# Altium project OT.PrjPcb (part 2 of 2)
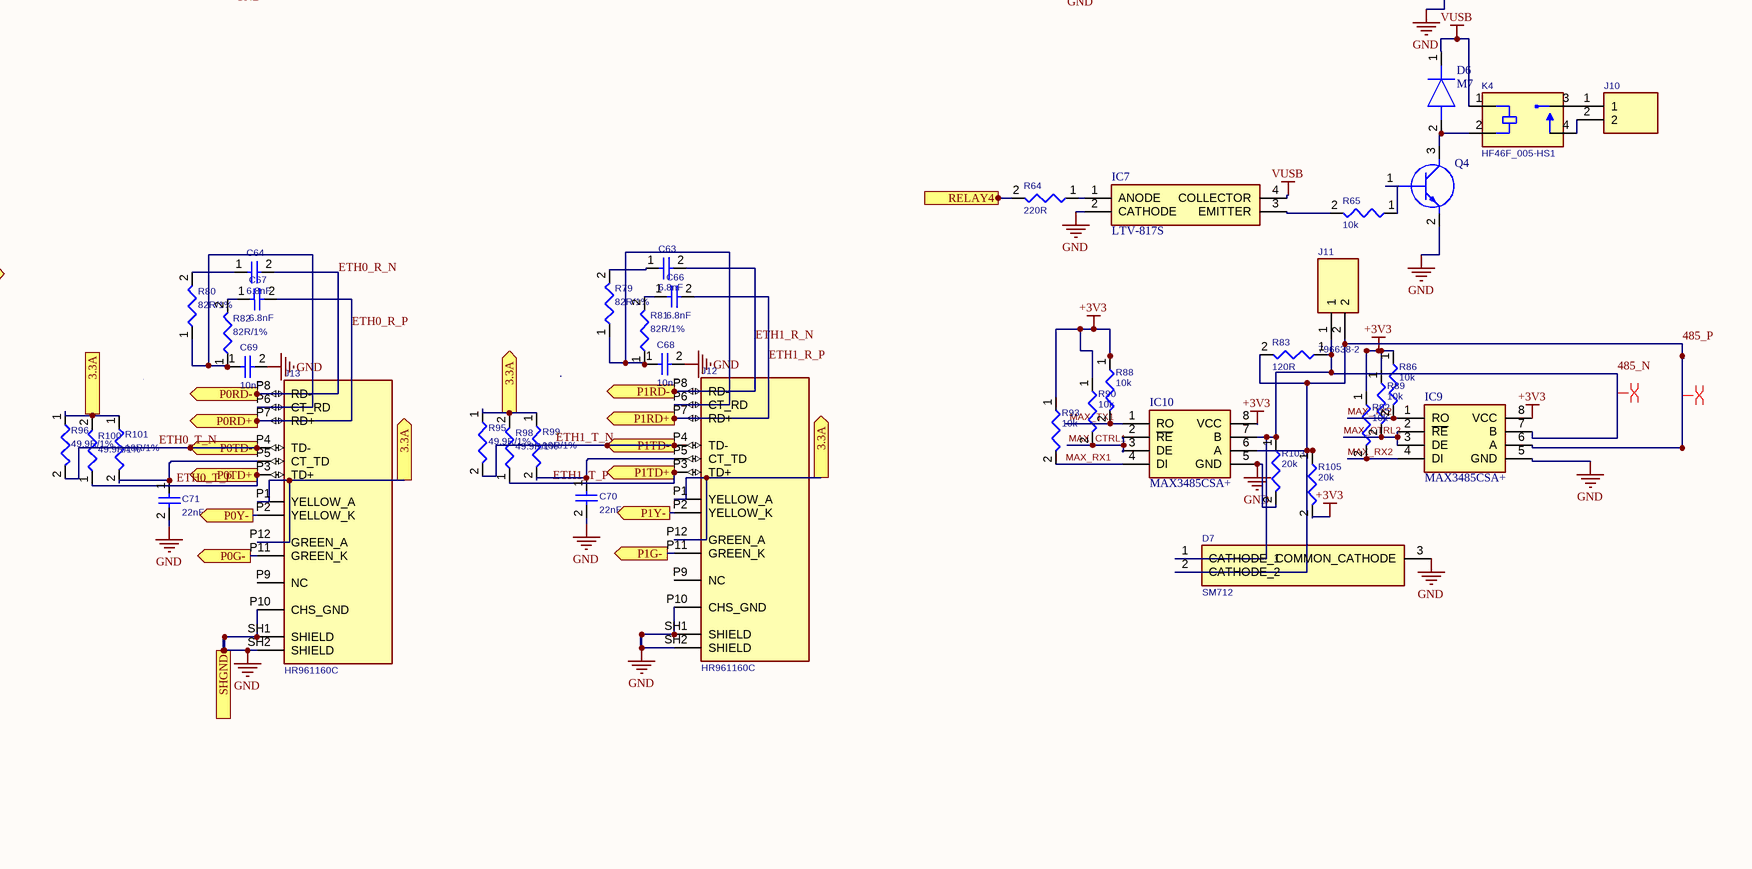
[diagram p4: Sheet_1.SchDoc, bottom right]

## Sheet Sheet_1.SchDoc (continued)

### Library data of the parts
B1 = RTL8367S-CG: Integrated Circuits (ICs) QFP; Manufacturer_Name: Realtek; Geometry.Height: 1.6mm; Manufacturer_Part_Number: RTL8367S-CG; Mouser Part Number: *; Mouser Price/Stock: *; Arrow Part Number: *; Arrow Price/Stock: *; Datasheet Link: https://datasheet.lcsc.com/lcsc/2103121437_Realtek-Semicon-RTL8367S-CG_C2760849.pdf
C1 C2 = C0603C104J4RACTU: Capacitor; Manufacturer_Name: KEMET; Datasheet Link: https://content.kemet.com/datasheets/KEM_C1002_X7R_SMD.pdf; Height: 0.87mm; Manufacturer_Part_Number: C0603C104J4RACTU; Mouser Part Number: 80-C0603C104J4R; Mouser Price/Stock: https://www.mouser.co.uk/ProductDetail/KEMET/C0603C104J4RACTU?qs=kWB%252BwhWP5%2Ff1r72Va246xA%3D%3D; Arrow Part Number: C0603C104J4RACTU; Arrow Price/Stock: https://www.arrow.com/en/products/c0603c104j4ractu/kemet-corporation?region=nac
C3 C6 C7 C10 C13-C33 C37-C45 C48 C49 C56 C57 C60 C62 C65 C68 C69 C72 C75 C76 C80 = CMP-001-00076-4: Chip Capacitor, .1µF +/-20%, 10V, 0603, Thickness 1 mm; Tolerance: 10%; Mounting Technology: SMT; Case/Package: 0603; Pins: 2; Min Operating Temperature: -55°C; Max Operating Temperature: 85°C; Voltage Rating: 10V
C4 C5 C8 C9 = CMP-001-00076-4: Chip Capacitor, 18 pF +/-20%, 10V, 0603, Thickness 1 mm; Tolerance: 10%; Mounting Technology: SMT; Case/Package: 0603; Pins: 2; Min Operating Temperature: -55°C; Max Operating Temperature: 85°C; Voltage Rating: 10V
C11 C12 C34-C36 C74 C77 C78 = TAJB105K050R: Manufacturer_Name: Kyocera AVX; Datasheet Link: http://datasheets.avx.com/TAJ.pdf; Height: 2.1mm; Manufacturer_Part_Number: TAJB105K050R
C46 C47 C58 C73 = CMP-001-00076-4: Chip Capacitor, 4.7µF +/-20%, 10V, 0603, Thickness 1 mm; Tolerance: 10%; Mounting Technology: SMT; Case/Package: 0603; Pins: 2; Min Operating Temperature: -55°C; Max Operating Temperature: 85°C; Voltage Rating: 10V
C50 C51 C70 C71 = CMP-001-00076-4: Chip Capacitor, 22nF +/-20%, 10V, 0603, Thickness 1 mm; Tolerance: 10%; Mounting Technology: SMT; Case/Package: 0603; Pins: 2; Min Operating Temperature: -55°C; Max Operating Temperature: 85°C; Voltage Rating: 10V
C52-C55 C63 C64 C66 C67 = CMP-001-00076-4: Chip Capacitor, 6.8nF +/-20%, 10V, 0603, Thickness 1 mm; Tolerance: 10%; Mounting Technology: SMT; Case/Package: 0603; Pins: 2; Min Operating Temperature: -55°C; Max Operating Temperature: 85°C; Voltage Rating: 10V
C59 C61 = CMP-001-00076-4: Chip Capacitor, 22pF +/-20%, 10V, 0603, Thickness 1 mm; Tolerance: 10%; Mounting Technology: SMT; Case/Package: 0603; Pins: 2; Min Operating Temperature: -55°C; Max Operating Temperature: 85°C; Voltage Rating: 10V
C79 = CMP-001-00076-4: Chip Capacitor, 10µF +/-20%, 10V, 0603, Thickness 1 mm; Tolerance: 10%; Mounting Technology: SMT; Case/Package: 0603; Pins: 2; Min Operating Temperature: -55°C; Max Operating Temperature: 85°C; Voltage Rating: 10V
CUTOUT1 = display_1
D1 = 1N5819HW-7-F: Diode Schottky 40 V 1A Surface Mount SOD-123; MF: Diodes Inc.; Value: *; SnapEDA_Link: https://www.snapeda.com/parts/1N5819HW-7-F/Diodes+Inc./view-part/?ref=snap; Purchase-URL: https://pricing.snapeda.com/search/part/1N5819HW-7-F/?ref=eda; Availability: In Stock; Price: None; Package: SOD-123 Fairchild Semiconductor; Check_prices: https://www.snapeda.com/parts/1N5819HW-7-F/Diodes+Inc./view-part/?ref=eda; MP: 1N5819HW-7-F
D2 = SM24CANB-02HTG: TVS Diode (Bi-directional); Manufacturer_Name: LITTELFUSE; Datasheet Link: https://www.littelfuse.com/products/overvoltage-protection/tvs-diode-arrays/general-purpose/sm24canb/sm24canb-02htg; Height: 1.12mm; Manufacturer_Part_Number: SM24CANB-02HTG; Mouser Part Number: 576-SM24CANB-02HTG; Mouser Price/Stock: https://www.mouser.co.uk/ProductDetail/Littelfuse/SM24CANB-02HTG?qs=bWsWnctWn1wbKmCYlcUmHw%3D%3D; Arrow Part Number: SM24CANB-02HTG; Arrow Price/Stock: https://www.arrow.com/en/products/sm24canb-02htg/littelfuse?utm_currency=USD&region=nac
D3-D6 = M7: Diode; Manufacturer_Name: LGE; Datasheet Link: https://datasheet.lcsc.com/szlcsc/LGE-M7-SMAJ_C330214.pdf; Height: 2.45mm; Manufacturer_Part_Number: M7
D7 = SM712: TVS Diode (Bi-directional); Manufacturer_Name: DOWO; Datasheet Link: https://datasheet.lcsc.com/szlcsc/DOWO-SM712_C293966.pdf; Height: 1.15mm; Manufacturer_Part_Number: SM712
F1-F3 = C0603C104J4RACTU: Ferrite bead; Manufacturer_Name: KEMET; Datasheet Link: https://content.kemet.com/datasheets/KEM_C1002_X7R_SMD.pdf; Height: 0.87mm; Manufacturer_Part_Number: C0603C104J4RACTU; Mouser Part Number: 80-C0603C104J4R; Mouser Price/Stock: https://www.mouser.co.uk/ProductDetail/KEMET/C0603C104J4RACTU?qs=kWB%252BwhWP5%2Ff1r72Va246xA%3D%3D; Arrow Part Number: C0603C104J4RACTU; Arrow Price/Stock: https://www.arrow.com/en/products/c0603c104j4ractu/kemet-corporation?region=nac
IC1 = ST1S10PHR: Integrated Circuit; Manufacturer_Name: STMicroelectronics; Datasheet Link: https://www.st.com/resource/en/datasheet/st1s10.pdf; Height: 1.7mm; Manufacturer_Part_Number: ST1S10PHR; Mouser Part Number: 511-ST1S10PHR; Mouser Price/Stock: https://www.mouser.co.uk/ProductDetail/STMicroelectronics/ST1S10PHR?qs=qolwYojYp3QSBN7PdO5xhg%3D%3D; Arrow Part Number: ST1S10PHR; Arrow Price/Stock: https://www.arrow.com/en/products/st1s10phr/stmicroelectronics?region=nac
IC2 IC8 = LM75BD,118: Integrated Circuit; Manufacturer_Name: NXP; Datasheet Link: http://www.nxp.com/docs/en/data-sheet/LM75B.pdf; Height: 1.75mm; Manufacturer_Part_Number: LM75BD,118; Mouser Part Number: 771-LM75BD118; Mouser Price/Stock: https://www.mouser.co.uk/ProductDetail/NXP-Semiconductors/LM75BD118?qs=tKEQ0l%252B78Dle%2FKEoz9Gpmw%3D%3D; Arrow Part Number: LM75BD,118; Arrow Price/Stock: https://www.arrow.com/en/products/lm75bd118/nxp-semiconductors?utm_currency=USD&region=nac
IC3 = SN65HVD230DR: Integrated Circuit; Manufacturer_Name: Texas Instruments; Datasheet Link: http://www.ti.com/lit/gpn/sn65hvd230; Height: 1.75mm; Manufacturer_Part_Number: SN65HVD230DR; Mouser Part Number: 595-SN65HVD230DR; Mouser Price/Stock: https://www.mouser.co.uk/ProductDetail/Texas-Instruments/SN65HVD230DR?qs=QViXGNcIEAtifeQR3pYVUQ%3D%3D; Arrow Part Number: SN65HVD230DR; Arrow Price/Stock: https://www.arrow.com/en/products/sn65hvd230dr/texas-instruments?utm_currency=USD&region=nac
IC4-IC7 = LTV-817S: Undefined or Miscellaneous; Manufacturer_Name: Lite-On; Datasheet Link: http://optoelectronics.liteon.com/upload/download/DS-70-96-0016/LTV-8X7%20series%20201610%20.pdf; Height: 4.6mm; Manufacturer_Part_Number: LTV-817S; Mouser Part Number: 859-LTV-817S; Mouser Price/Stock: https://www.mouser.co.uk/ProductDetail/Lite-On/LTV-817S?qs=XpF7qU%252BvLkWYeWEC0OckNQ%3D%3D; Arrow Part Number: LTV-817S; Arrow Price/Stock: https://www.arrow.com/en/products/ltv-817s/lite-on-technology?utm_currency=USD&region=nac
IC9 IC10 = MAX3485CSA+: Integrated Circuit; Manufacturer_Name: Analog Devices; Datasheet Link: http://datasheets.maximintegrated.com/en/ds/MAX3483-MAX3491.pdf; Height: 1.75mm; Manufacturer_Part_Number: MAX3485CSA+; Mouser Part Number: 700-MAX3485CSA; Mouser Price/Stock: https://www.mouser.co.uk/ProductDetail/Analog-Devices-Maxim-Integrated/MAX3485CSA%2b?qs=1THa7WoU59EwF6JizZr35Q%3D%3D; Arrow Part Number: MAX3485CSA+; Arrow Price/Stock: https://www.arrow.com/en/products/max3485csa/analog-devices?utm_currency=USD&region=nac
IC11 = AT24C02C-SSHM-T: Integrated Circuit; Manufacturer_Name: Microchip; Datasheet Link: https://componentsearchengine.com/Datasheets/2/AT24C02C-SSHM-T.pdf; Height: 1.75mm; Manufacturer_Part_Number: AT24C02C-SSHM-T; Mouser Part Number: 556-AT24C02C-SSHM-T; Mouser Price/Stock: https://www.mouser.co.uk/ProductDetail/Microchip-Technology/AT24C02C-SSHM-T?qs=GIS3PBbICsf0%252BNDfAcM6vQ%3D%3D; Arrow Part Number: AT24C02C-SSHM-T; Arrow Price/Stock: https://www.arrow.com/en/products/at24c02c-sshm-t/microchip-technology?utm_currency=USD&region=nac
J1 J2 = TYPE-C-31-M-12: USB Connectors 24 Receptacle 1 8.94*7.3mm RoHS; MF: HRO Electronics Co., Ltd.; SnapEDA_Link: https://www.snapeda.com/parts/TYPE-C-31-M-12/HRO+Electronics+Co.%252C+Ltd./view-part/?ref=snap; Package: Package; Value: *; MP: TYPE-C-31-M-12; Check_prices: https://www.snapeda.com/parts/TYPE-C-31-M-12/HRO+Electronics+Co.%252C+Ltd./view-part/?ref=eda
J3 J5 J6 J9-J11 = 796638-2: Connector; Manufacturer_Name: TE Connectivity; Datasheet Link: https://www.te.com/commerce/DocumentDelivery/DDEController?Action=srchrtrv&DocNm=1-773958-1&DocType=Data%20Sheet&DocLang=English&PartCntxt=796638-2&DocFormat=pdf; Height: 8.5mm; Manufacturer_Part_Number: 796638-2; Mouser Part Number: 571-7966382; Mouser Price/Stock: https://www.mouser.co.uk/ProductDetail/TE-Connectivity/796638-2?qs=OgP1KchuM4OGTMRdQOKfPQ%3D%3D; Arrow Part Number: 796638-2; Arrow Price/Stock: https://www.arrow.com/en/products/796638-2/te-connectivity?utm_currency=USD&region=nac
J4 J14 = B3B-XH-A_LF__SN_: Connector; Manufacturer_Name: JST (JAPAN SOLDERLESS TERMINALS); Manufacturer_Part_Number: B3B-XH-A(LF)(SN); Datasheet Link: https://datasheet.lcsc.com/szlcsc/1812131720_JST-Sales-America-B3B-XH-A-LF-SN_C144394.pdf; Height: 7mm; Mouser Part Number: 306-B3BXHALFSNP; Mouser Price/Stock: https://www.mouser.co.uk/ProductDetail/JST-Commercial/B3B-XH-ALFSN?qs=cdbOS8ANM9BVkoboCCIEMQ%3D%3D; Arrow Part Number: B3B-XH-A(LF)(SN); Arrow Price/Stock: https://www.arrow.com/en/products/b3b-xh-a-lf-sn/jst-manufacturing?utm_currency=USD&region=europe
J7 J8 = LP2019ANL: SINGLE PORT, 10/100 BASE-T ETHERNET TRANSFORMER MODULES; Manufacturer_Name: LINK-PP; Geometry.Height: 6.2mm; Manufacturer_Part_Number: LP2019ANL; Mouser Part Number: *; Mouser Price/Stock: *; Arrow Part Number: *; Arrow Price/Stock: *; Datasheet Link: *
J12 J13 = HR961160C: 1x1 Port Tab-UP Surface Mount RJ45 Connector with Magnetics Module and LEDfor 10/100Base-TX NIC Applications.; MF: HanRun; SnapEDA_Link: https://www.snapeda.com/parts/HR961160C/HanRun/view-part/?ref=snap; Package: Package; Value: *; MP: HR961160C; Check_prices: https://www.snapeda.com/parts/HR961160C/HanRun/view-part/?ref=eda
K1-K4 = HF46F_005-HS1: Relay: electromagnetic; SPST-NO; Ucoil: 5VDC; 5A/250VAC; 5A/30VDC; MF: Hongfa; MP: HF46F/005-HS1; SnapEDA_Link: https://www.snapeda.com/parts/HF46F/005-HS1/Hongfa/view-part/?ref=snap; Package: None; Value: *; Check_prices: https://www.snapeda.com/parts/HF46F/005-HS1/Hongfa/view-part/?ref=eda
L1 L2 = 74438366047: Inductor; Manufacturer_Name: Wurth Elektronik; Datasheet Link: https://www.mouser.de/datasheet/2/445/74438366047-1729684.pdf; Height: 2.1mm; Manufacturer_Part_Number: 74438366047; Mouser Part Number: 710-74438366047; Mouser Price/Stock: https://www.mouser.co.uk/ProductDetail/Wurth-Elektronik/74438366047?qs=GBLSl2AkirtLXcWmtAjOXQ%3D%3D
LED1-LED13 = 19-213_G6C-AN1P2B_3T: LED; Manufacturer_Name: Everlight; Manufacturer_Part_Number: 19-213/G6C-AN1P2B/3T; Datasheet Link: https://componentsearchengine.com/Datasheets/1/19-213_G6C-AN1P2B_3T.pdf; Height: 0.6mm; Mouser Part Number: 638-19213G6CAN1P2B3T; Mouser Price/Stock: https://www.mouser.com/Search/Refine.aspx?Keyword=638-19213G6CAN1P2B3T
Q1-Q5 = MMBT2222A-G: Transistor BJT NPN; Manufacturer_Name: Comchip Technology; Datasheet Link: https://datasheet.datasheetarchive.com/originals/distributors/Datasheets-7/DSA-138996.pdf; Height: 1.15mm; Manufacturer_Part_Number: MMBT2222A-G; Mouser Part Number: 750-MMBT2222A-G; Mouser Price/Stock: https://www.mouser.co.uk/ProductDetail/Comchip-Technology/MMBT2222A-G?qs=2qJf6qQ4IOIM%2FSE9iCL8gQ%3D%3D; Arrow Part Number: MMBT2222A-G; Arrow Price/Stock: https://www.arrow.com/en/products/mmbt2222a-g/comchip-technology?region=nac
R1 R2 R5 R6 R38 R39 R99 R101 = CMP-009-00031-5: Chip Resistor, 10 Ohm, +/- 1%, 0.1 W, -55 to 155 degC, 0603 (1608 Metric); Power: 100mW; Tolerance: 1%; Mounting Technology: SM; Case/Package: 0603; RoHS Compliant: True; Pins: 2; Min Operating Temperature: -55°C; Max Operating Temperature: 155°C
R3 = CMP-009-00031-5: Chip Resistor, 820 Ohm, +/- 1%, 0.1 W, -55 to 155 degC, 0603 (1608 Metric); Power: 100mW; Tolerance: 1%; Mounting Technology: SM; Case/Package: 0603; RoHS Compliant: True; Pins: 2; Min Operating Temperature: -55°C; Max Operating Temperature: 155°C
R4 = CMP-009-00017-5: Chip Resistor, 270 KOhm, +/- 1%, 01 W, -55 to 155 degC, 0603 (1608 Metric); Voltage Rating: 50V; Power: 100mW; RoHS Compliant: True; Min Operating Temperature: -55°C; Pins: 2; Case/Package: 0603; Mounting Technology: SM; Max Operating Temperature: 155°C; Tolerance: 1%
R7 = CMP-009-00017-5: Chip Resistor, 86 KOhm, +/- 1%, 01 W, -55 to 155 degC, 0603 (1608 Metric); Voltage Rating: 50V; Power: 100mW; RoHS Compliant: True; Min Operating Temperature: -55°C; Pins: 2; Case/Package: 0603; Mounting Technology: SM; Max Operating Temperature: 155°C; Tolerance: 1%
R8-R10 R15 R18 R19 R21 R23 R25 R26 R29 R67 R69 R70 R73 R78 = CMP-009-00031-5: Chip Resistor, 4.7 KOhm, +/- 1%, 0.1 W, -55 to 155 degC, 0603 (1608 Metric); Power: 100mW; Tolerance: 1%; Mounting Technology: SM; Case/Package: 0603; RoHS Compliant: True; Pins: 2; Min Operating Temperature: -55°C; Max Operating Temperature: 155°C
R11 R83 = CMP-009-00031-5: Chip Resistor, 120 Ohm, +/- 1%, 0.1 W, -55 to 155 degC, 0603 (1608 Metric); Power: 100mW; Tolerance: 1%; Mounting Technology: SM; Case/Package: 0603; RoHS Compliant: True; Pins: 2; Min Operating Temperature: -55°C; Max Operating Temperature: 155°C
R12 R13 = CMP-009-00031-5: Chip Resistor, 1MOhm, +/- 1%, 0.1 W, -55 to 155 degC, 0603 (1608 Metric); Power: 100mW; Tolerance: 1%; Mounting Technology: SM; Case/Package: 0603; RoHS Compliant: True; Pins: 2; Min Operating Temperature: -55°C; Max Operating Temperature: 155°C
R14 R16 R17 R20 R22 R28 R30-R32 = CMP-009-00031-5: Chip Resistor, 0 Ohm, +/- 1%, 0.1 W, -55 to 155 degC, 0603 (1608 Metric); Power: 100mW; Tolerance: 1%; Mounting Technology: SM; Case/Package: 0603; RoHS Compliant: True; Pins: 2; Min Operating Temperature: -55°C; Max Operating Temperature: 155°C
R24 R37 R56 R64 = CMP-009-00031-5: Chip Resistor, 220 Ohm, +/- 1%, 0.1 W, -55 to 155 degC, 0603 (1608 Metric); Power: 100mW; Tolerance: 1%; Mounting Technology: SM; Case/Package: 0603; RoHS Compliant: True; Pins: 2; Min Operating Temperature: -55°C; Max Operating Temperature: 155°C
R27 R40 R43 R45 R59 R65 R84-R90 R92 R93 R107 R109 = CMP-009-00031-5: Chip Resistor, 10 KOhm, +/- 1%, 0.1 W, -55 to 155 degC, 0603 (1608 Metric); Power: 100mW; Tolerance: 1%; Mounting Technology: SM; Case/Package: 0603; RoHS Compliant: True; Pins: 2; Min Operating Temperature: -55°C; Max Operating Temperature: 155°C
R33 R34 = CMP-009-00031-5: Chip Resistor, 12 KOhm, +/- 1%, 0.1 W, -55 to 155 degC, 0603 (1608 Metric); Power: 100mW; Tolerance: 1%; Mounting Technology: SM; Case/Package: 0603; RoHS Compliant: True; Pins: 2; Min Operating Temperature: -55°C; Max Operating Temperature: 155°C
R35 R36 R41 R42 R95 R96 R98 R100 = CMP-009-00031-5: Chip Resistor, 49.9Ohm, +/- 1%, 0.1 W, -55 to 155 degC, 0603 (1608 Metric); Power: 100mW; Tolerance: 1%; Mounting Technology: SM; Case/Package: 0603; RoHS Compliant: True; Pins: 2; Min Operating Temperature: -55°C; Max Operating Temperature: 155°C
R44 R50 R55 R60 R106 R110-R112 = CMP-009-00031-5: Chip Resistor, 300 Ohm, +/- 1%, 0.1 W, -55 to 155 degC, 0603 (1608 Metric); Power: 100mW; Tolerance: 1%; Mounting Technology: SM; Case/Package: 0603; RoHS Compliant: True; Pins: 2; Min Operating Temperature: -55°C; Max Operating Temperature: 155°C
R46-R49 R79-R82 = CMP-009-00031-5: Chip Resistor, 82 Ohm, +/- 1%, 0.1 W, -55 to 155 degC, 0603 (1608 Metric); Power: 100mW; Tolerance: 1%; Mounting Technology: SM; Case/Package: 0603; RoHS Compliant: True; Pins: 2; Min Operating Temperature: -55°C; Max Operating Temperature: 155°C
R51-R54 = CMP-009-00031-5: Chip Resistor, 75 Ohm, +/- 1%, 0.1 W, -55 to 155 degC, 0603 (1608 Metric); Power: 100mW; Tolerance: 1%; Mounting Technology: SM; Case/Package: 0603; RoHS Compliant: True; Pins: 2; Min Operating Temperature: -55°C; Max Operating Temperature: 155°C
R57 R58 R61 R62 = CMP-009-00031-5: Chip Resistor, 150 Ohm, +/- 1%, 0.1 W, -55 to 155 degC, 0603 (1608 Metric); Power: 100mW; Tolerance: 1%; Mounting Technology: SM; Case/Package: 0603; RoHS Compliant: True; Pins: 2; Min Operating Temperature: -55°C; Max Operating Temperature: 155°C
R63 = CMP-009-00031-5: Chip Resistor, 300 KOhm, +/- 1%, 0.1 W, -55 to 155 degC, 0603 (1608 Metric); Power: 100mW; Tolerance: 1%; Mounting Technology: SM; Case/Package: 0603; RoHS Compliant: True; Pins: 2; Min Operating Temperature: -55°C; Max Operating Temperature: 155°C
R66 R68 R71 R72 R74-R77 R104 = CMP-009-00031-5: Chip Resistor, 470 Ohm, +/- 1%, 0.1 W, -55 to 155 degC, 0603 (1608 Metric); Power: 100mW; Tolerance: 1%; Mounting Technology: SM; Case/Package: 0603; RoHS Compliant: True; Pins: 2; Min Operating Temperature: -55°C; Max Operating Temperature: 155°C
R91 R94 R97 = CMP-009-00031-5: Chip Resistor, 1.5 KOhm, +/- 1%, 0.1 W, -55 to 155 degC, 0603 (1608 Metric); Power: 100mW; Tolerance: 1%; Mounting Technology: SM; Case/Package: 0603; RoHS Compliant: True; Pins: 2; Min Operating Temperature: -55°C; Max Operating Temperature: 155°C
R102 = CMP-009-00031-5: Chip Resistor, 20 Ohm, +/- 1%, 0.1 W, -55 to 155 degC, 0603 (1608 Metric); Power: 100mW; Tolerance: 1%; Mounting Technology: SM; Case/Package: 0603; RoHS Compliant: True; Pins: 2; Min Operating Temperature: -55°C; Max Operating Temperature: 155°C
R103 R105 = CMP-009-00031-5: Chip Resistor, 20 KOhm, +/- 1%, 0.1 W, -55 to 155 degC, 0603 (1608 Metric); Power: 100mW; Tolerance: 1%; Mounting Technology: SM; Case/Package: 0603; RoHS Compliant: True; Pins: 2; Min Operating Temperature: -55°C; Max Operating Temperature: 155°C
R108 = CMP-009-00031-5: Chip Resistor, 100 KOhm, +/- 1%, 0.1 W, -55 to 155 degC, 0603 (1608 Metric); Power: 100mW; Tolerance: 1%; Mounting Technology: SM; Case/Package: 0603; RoHS Compliant: True; Pins: 2; Min Operating Temperature: -55°C; Max Operating Temperature: 155°C
R113 = RK73H1JTTD1001F: Resistor; Manufacturer_Name: KOA Speer; Datasheet Link: http://www.koaspeer.com/catimages/Products/RK73-RT/RK73-RT.pdf; Height: 0.55mm; Manufacturer_Part_Number: RK73H1JTTD1001F; Mouser Part Number: 660-RK73H1JTTD1001F; Mouser Price/Stock: https://www.mouser.co.uk/ProductDetail/KOA-Speer/RK73H1JTTD1001F?qs=LDe0C6QMEhjxBAtFZK22kg%3D%3D; Arrow Part Number: RK73H1JTTD1001F; Arrow Price/Stock: https://www.arrow.com/en/products/rk73h1jttd1001f/koa-speer-electronics?utm_currency=USD&region=nac
S1-S4 = TS-1088-AR02016: 50mA 4mm 100MÎ© 100,000 Times 12V 160gf 3mm 2mm Round Button Vertical welding SPST SMD Tactile Switches ROHS; MF: Xunpu; SnapEDA_Link: https://www.snapeda.com/parts/TS-1088-AR02016/Xunpu/view-part/?ref=snap; Package: Package; Value: *; MP: TS-1088-AR02016; Check_prices: https://www.snapeda.com/parts/TS-1088-AR02016/Xunpu/view-part/?ref=eda
U1 U2 = W5500: Hardwired TCP/IP embedded Ethernet controller; Availability: Unavailable; MP: W5500; Value: *; Price: None; Package: None
U3 U4 = ESP32-C6-WROOM-1-N8: MF: Espressif Systems; SnapEDA_Link: https://www.snapeda.com/parts/ESP32-C6-WROOM-1-N8/Espressif+Systems/view-part/?ref=snap; Package: SMD-28 Espressif Systems; Value: *; MP: ESP32-C6-WROOM-1-N8; Check_prices: https://www.snapeda.com/parts/ESP32-C6-WROOM-1-N8/Espressif+Systems/view-part/?ref=eda
U5 = SC0195(9): The Raspberry Pi 4 Model B SC0195-9 single board computer features a powerful Broadcom BCM2711 ARM Cortex-A72 processor with 1.5GHz speed and four cores, making it ideal for demanding embedded computing applications. With 8GB of RAM and a compact size of; SnapEDA_Link: https://www.snapeda.com/parts/SC0195(9)/Raspberry+Pi/view-part/?ref=snap; Package: None; Value: *; MF: Raspberry Pi; MP: SC0195(9); Check_prices: https://www.snapeda.com/parts/SC0195(9)/Raspberry+Pi/view-part/?ref=eda
W1 W2 = 5110: Jumper Zero Ohm SMT Reel | Keystone Electronics 5110; MF: Keystone Electronics Corp.; SnapEDA_Link: https://www.snapeda.com/parts/5110/Keystone/view-part/?ref=snap; Package: None; Value: *; MP: 5110; Check_prices: https://www.snapeda.com/parts/5110/Keystone/view-part/?ref=eda
Y1 Y2 = 7M25000014: 25 MHz Â±10ppm Crystal 18pF 4-SMD, No Lead; MF: TXC; SnapEDA_Link: https://www.snapeda.com/parts/7M25000014/TXC/view-part/?ref=snap; Purchase-URL: https://pricing.snapeda.com/search/part/7M25000014/?ref=eda; MP: 7M25000014; Check_prices: https://www.snapeda.com/parts/7M25000014/TXC/view-part/?ref=eda; Availability: In Stock; Package: NON STANDARD-4 TXC; Price: None; Value: *
Y3 = ABM3B-25.000MHZ-22-E4H-T: 25 MHz ±30ppm Crystal 22pF 50 Ohms 4-SMD, No Lead; MF: Abracon; SnapEDA_Link: https://www.snapeda.com/parts/ABM3B-25.000MHZ-22-E4H-T/Abracon/view-part/?ref=snap; Package: Package; Value: *; MP: ABM3B-25.000MHZ-22-E4H-T; Check_prices: https://www.snapeda.com/parts/ABM3B-25.000MHZ-22-E4H-T/Abracon/view-part/?ref=eda